# Altium schematic sheet LEFT_CCM.SchDoc: =project_title
size Tabloid; PageSetup: Record=PageOptions|CenterHorizontal=True|CenterVertical=True|PrintScale=0.71|XCorrection=1.00|YCorrection=1.00|PrintKind=0|BorderSize=5000000|LeftOffset=0|BottomOffset=0|Orientation=2|PaperLength=1000|PaperWidth=1000|Scale=100|PaperSource=7|PrintQuality=-4|MediaType=1|DitherType=10|PrintScaleMode=1|PaperKind=A4; CompanyName: Luxonis Holding; Organization: Luxonis Holding; Address1: 1925 Harmony Park Drive; Address2: Westminster, CO; Address3: 80234; Address4: United States; SheetNumber: 10; SheetTotal: 14
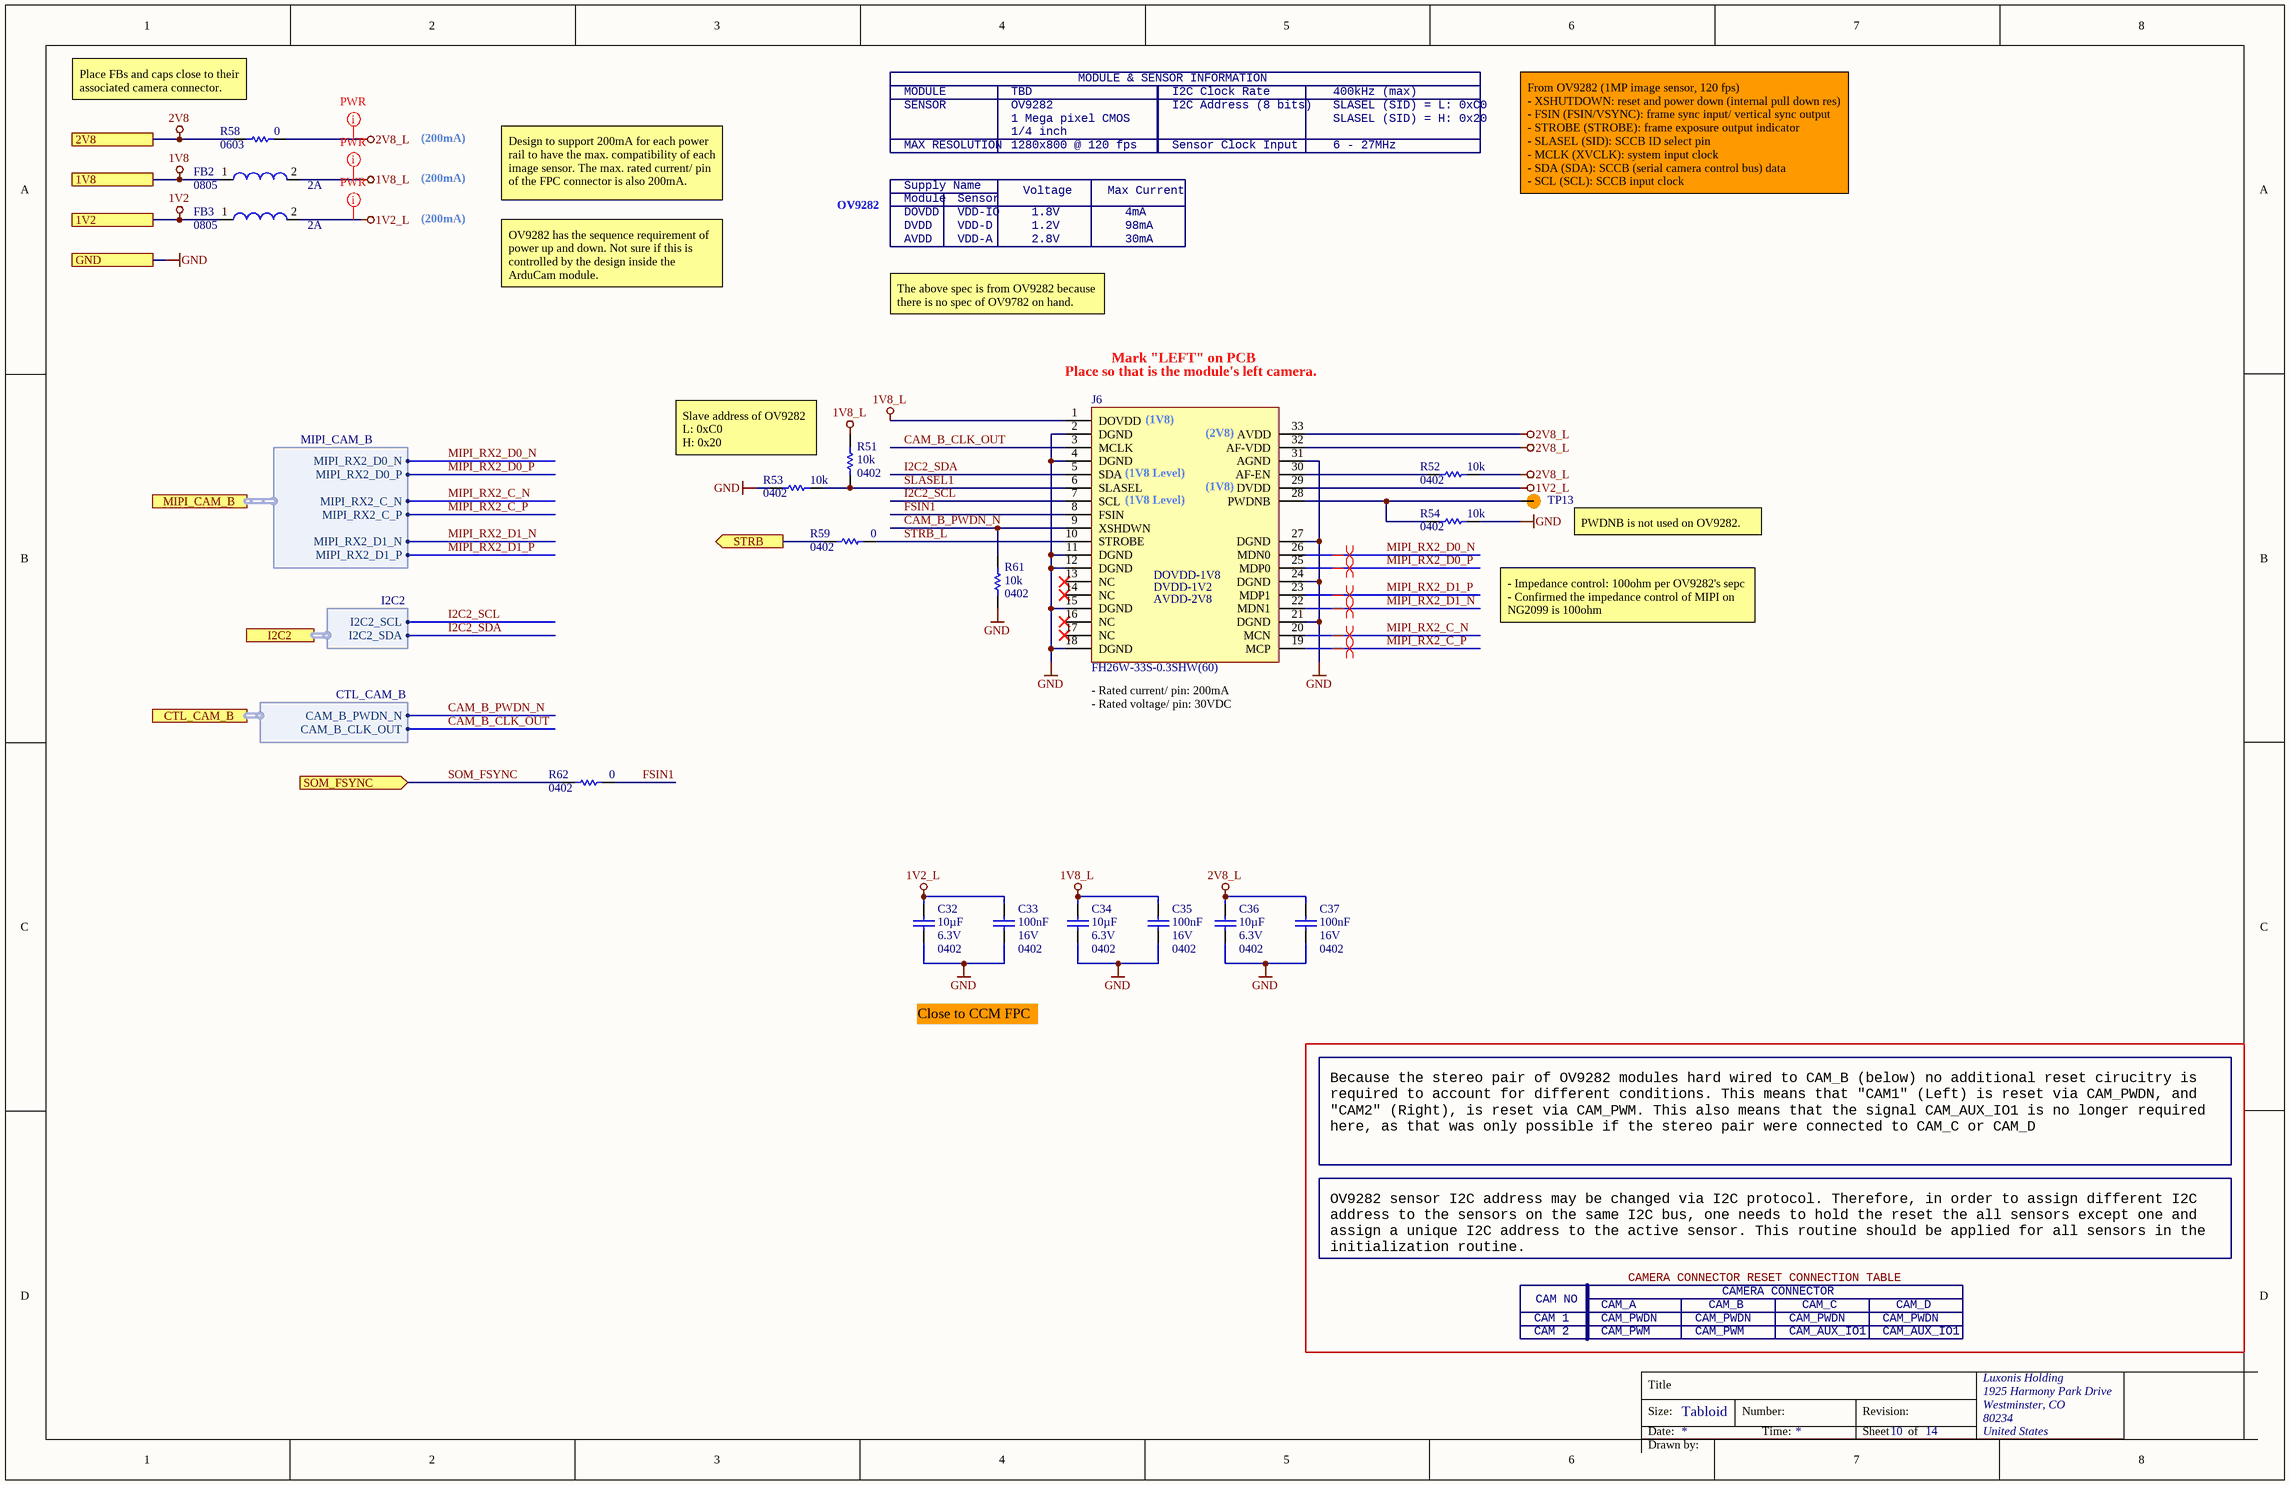
[diagram p0: LEFT_CCM.SchDoc]

## Parts
C32  value 10µF  Voltage Rating: 6.3V  Case/Package: 0402  [CAPC0402(1005)70_N]  (hidden comment: GRM155R60J106ME15D)
C33  value 100nF  Voltage Rating: 16V  Case/Package: 0402  [CAPC0402(1005)60_N]  (hidden comment: CL05B104KO5NFNC)
C34  value 10µF  Voltage Rating: 6.3V  Case/Package: 0402  [CAPC0402(1005)70_N]  (hidden comment: GRM155R60J106ME15D)
C35  value 100nF  Voltage Rating: 16V  Case/Package: 0402  [CAPC0402(1005)60_N]  (hidden comment: CL05B104KO5NFNC)
C36  value 10µF  Voltage Rating: 6.3V  Case/Package: 0402  [CAPC0402(1005)70_N]  (hidden comment: GRM155R60J106ME15D)
C37  value 100nF  Voltage Rating: 16V  Case/Package: 0402  [CAPC0402(1005)60_N]  (hidden comment: CL05B104KO5NFNC)
FB2  Current Rating: 2A  Case/Package: 0805  [2508056017Y2]  (hidden comment: 2508056017Y2)
FB3  Current Rating: 2A  Case/Package: 0805  [2508056017Y2]  (hidden comment: 2508056017Y2)
J6  FH26W-33S-0.3SHW(60)  [AC-PY003-OV9282]
R51  value 10k  Case/Package: 0402  [RESC0402(1005)_N]  (hidden comment: RC0402FR-1310KL)
R52  value 10k  Case/Package: 0402  [RESC0402(1005)_N]  (hidden comment: RC0402FR-1310KL)
R53  value 10k  Case/Package: 0402  [RESC0402(1005)_N]  (hidden comment: RC0402FR-1310KL)
R54  value 10k  Case/Package: 0402  [RESC0402(1005)_N]  (hidden comment: RC0402FR-1310KL)
R58  value 0  Case/Package: 0603  [RESC0603(1608)_N]  (hidden comment: CRCW06030000Z0EA)
R59  value 0  Case/Package: 0402  [RESC0402(1005)_L]  (hidden comment: CRCW04020000Z0ED)
R61  value 10k  Case/Package: 0402  [RESC0402(1005)_N]  (hidden comment: RC0402FR-1310KL)
R62  value 0  Case/Package: 0402  [RESC0402(1005)_L]  (hidden comment: CRCW04020000Z0ED)
TP13  TP075_150_NS  [TP075_150_NS]  (value not drawn)  (no BOM)

## Ports
1V2, 1V8, 2V8, CTL_CAM_B (harness CTL_CAM_B), GND, I2C2 (harness I2C2), MIPI_CAM_B (harness MIPI_CAM_B), SOM_FSYNC (in), STRB (out)

## Harnesses
MIPI_CAM_B: MIPI_RX2_D1_P, MIPI_RX2_D1_N, MIPI_RX2_D0_N, MIPI_RX2_D0_P, MIPI_RX2_C_N, MIPI_RX2_C_P
I2C2: I2C2_SDA, I2C2_SCL
CTL_CAM_B: CAM_B_PWDN_N, CAM_B_CLK_OUT

## Nets
1V2: FB3.1 ; port 1V2
1V2_L: C32.2 C33.2 FB3.2 J6.29(DVDD)
1V8: FB2.1 ; port 1V8
1V8_L: C34.2 C35.2 FB2.2 J6.1(DOVDD) R51.2
2V8: R58.1 ; port 2V8
2V8_L: C36.2 C37.2 J6.32(AF-VDD) J6.33(AVDD) R52.2 R58.2
GND: C32.1 C33.1 C34.1 C35.1 C36.1 C37.1 J6.2(DGND) J6.4(DGND) J6.11(DGND) J6.12(DGND) J6.15(DGND) J6.18(DGND) J6.21(DGND) J6.24(DGND) J6.27(DGND) J6.31(AGND) R53.1 R54.2 R61.1 ; port GND
CAM_B_CLK_OUT: J6.3(MCLK) ; port CTL_CAM_B.CAM_B_CLK_OUT
CAM_B_PWDN_N: J6.9(XSHDWN) R61.2 ; port CTL_CAM_B.CAM_B_PWDN_N
FSIN1: J6.8(FSIN) R62.1
I2C2_SCL: J6.7(SCL) ; port I2C2.I2C2_SCL
I2C2_SDA: J6.5(SDA) ; port I2C2.I2C2_SDA
MIPI_RX2_C_N: J6.20(MCN) ; port MIPI_CAM_B.MIPI_RX2_C_N
MIPI_RX2_C_P: J6.19(MCP) ; port MIPI_CAM_B.MIPI_RX2_C_P
MIPI_RX2_D0_N: J6.26(MDN0) ; port MIPI_CAM_B.MIPI_RX2_D0_N
MIPI_RX2_D0_P: J6.25(MDP0) ; port MIPI_CAM_B.MIPI_RX2_D0_P
MIPI_RX2_D1_N: J6.22(MDN1) ; port MIPI_CAM_B.MIPI_RX2_D1_N
MIPI_RX2_D1_P: J6.23(MDP1) ; port MIPI_CAM_B.MIPI_RX2_D1_P
SLASEL1: J6.6(SLASEL) R51.1 R53.2
SOM_FSYNC: R62.2 ; port SOM_FSYNC
STRB: R59.2 ; port STRB
STRB_L: J6.10(STROBE) R59.1
NetJ6_28: J6.28(PWDNB) R54.1 TP13.1
NetJ6_30: J6.30(AF-EN) R52.1

Not connected (* = marked no-connect by the designer): J6 13(NC)* 14(NC)* 16(NC)* 17(NC)*

## Layout directives
differential pair; net class MIPI; differential pair class 100ohm: MIPI_RX2_C_N, MIPI_RX2_C_P, MIPI_RX2_D0_N, MIPI_RX2_D0_P, MIPI_RX2_D1_N, MIPI_RX2_D1_P
net class PWR; Current Rating: 200mA: 1V2_L, 1V8_L, 2V8_L

## Notes on the sheet
- (near R58) Place FBs and caps close to their associated camera connector.
- MODULE
- TBD
- MODULE & SENSOR INFORMATION
- I2C Clock Rate
- 400kHz (max)
- (200mA)
- SENSOR
- MAX RESOLUTION
- 1 Mega pixel CMOS
- 1280x800 @ 120 fps
- OV9282
- 1/4 inch
- I2C Address (8 bits)
- Sensor Clock Input
- SLASEL (SID) = L: 0xC0
- SLASEL (SID) = H: 0x20
- 6 - 27MHz
- Design to support 200mA for each power rail to have the max. compatibility of each image sensor. The max. rated current/ pin of the FPC connector is also 200mA.
- DOVDD
- DVDD
- Supply Name
- Module
- VDD-IO
- VDD-D
- Sensor
- Voltage
- 1.8V
- 1.2V
- Max Current
- 4mA
- 98mA
- From OV9282 (1MP image sensor, 120 fps)
  - XSHUTDOWN: reset and power down (internal pull down res)
  - FSIN (FSIN/VSYNC): frame sync input/ vertical sync output
  - STROBE (STROBE): frame exposure output indicator
  - SLASEL (SID): SCCB ID select pin
  - MCLK (XVCLK): system input clock
  - SDA (SDA): SCCB (serial camera control bus) data
  - SCL (SCL): SCCB input clock
- OV9282 has the sequence requirement of power up and down. Not sure if this is controlled by the design inside the ArduCam module.
- AVDD
- VDD-A
- 2.8V
- 30mA
- The above spec is from OV9282 because there is no spec of OV9782 on hand.
- Mark "LEFT" on PCB
- (near J6) Place so that is the module's left camera.
- (near J6) (1V8)
- (near J6) (2V8)
- Slave address of OV9282
  L: 0xC0
  H: 0x20
- (near J6) (1V8 Level)
- (near TP13) PWDNB is not used on OV9282.
- - Impedance control: 100ohm per OV9282's sepc
  - Confirmed the impedance control of MIPI on NG2099 is 100ohm
- (near J6) - Rated current/ pin: 200mA
  - Rated voltage/ pin: 30VDC
- Close to CCM FPC
- Because the stereo pair of OV9282 modules hard wired to CAM_B (below) no additional reset cirucitry is required to account for different conditions. This means that "CAM1" (Left) is reset via CAM_PWDN, and "CAM2" (Right), is reset via CAM_PWM. This also means that the signal CAM_AUX_IO1 is no longer required here, as that was only possible if the stereo pair were connected to CAM_C or CAM_D
- OV9282 sensor I2C address may be changed via I2C protocol. Therefore, in order to assign different I2C address to the sensors on the same I2C bus, one needs to hold the reset the all sensors except one and assign a unique I2C address to the active sensor. This routine should be applied for all sensors in the initialization routine.
- CAM NO
- CAMERA CONNECTOR RESET CONNECTION TABLE
- CAMERA CONNECTOR
- CAM 1
- CAM 2
- CAM_A
- CAM_PWDN
- CAM_PWM
- CAM_B
- CAM_AUX_IO1
- CAM_C
- CAM_D
- Title
- Size:
- Date:
- Tabloid
- Number:
- Time:
- Revision:
- Sheet
- of
- Drawn by:
- (in symbol AC_PY003-OV9282_CON) DOVDD-1V8; DVDD-1V2; AVDD-2V8

## Library data of the parts
C32 C34 C36 = CMP-004-000009-5: CAP CER 10UF 6.3V X5R 0402 20%; Manufacturer 1: Murata; Dielectric: X5R; Manufacturer Part Number 1: GRM155R60J106ME15D; ComponentLink1URL: https://www.murata.com/~/media/webrenewal/support/library/catalog/products/capacitor/mlcc/c02e.ashx?la=en-us&src-supplier=Digi-Key; Design Item ID: GRM155R60J106ME15D; Tolerance: 20%; Width: 0.02inch; Length: 0.039inch; Mounting Technology: SMT; Min Operating Temperature: -55°C; Max Operating Temperature: 85°C; ComponentLink1Description: https://www.murata.com/~/media/webrenewal/support/library/catalog/products/capacitor/mlcc/c02e.ashx?la=en-us&src-supplier=Digi-Key
C33 C35 C37 = CMP-108-000002-6: CAP CER 0.1UF 16V X7R 0402 10%; Manufacturer 1: Samsung; ComponentLink1URL: https://datasheet.ciiva.com/25767/cl05b104ko5nfnc-25767124.pdf?src-supplier=Digi-Key; Length: 1mm; Design Item ID: CL05B104KO5NFNC; Tolerance: 10%; Min Operating Temperature: -55°C; Width: 0.02inch; Dielectric: X7R; ComponentLink1Description: https://datasheet.ciiva.com/25767/cl05b104ko5nfnc-25767124.pdf?src-supplier=Digi-Key; Height: 0.5mm; Depth: 0.5mm; Manufacturer Part Number 1: CL05B104KO5NFNC; Max Operating Temperature: 125°C; Mounting Technology: SMT
FB2 FB3 = CMP-082-000000-2: FERRITE BEAD, 0.1OHM, 2A, 0805, 600R/100MHz; Manufacturer 1: Fair-Rite; Tolerance: 25%; Manufacturer Part Number 1: 2508056017Y2
J6 = AC_PY003-OV9282_CON: FFC/FPC Connector, 33 Contact(s), 1 Row(s), Female, Right Angle, Surface Mount Terminal; Manufacturer 1: Hirose; Supplier 1: Digi-Key; Manufacturer Part Number 1: FH26W-33S-0.3SHW(60); RoHS: Yes; Category: FFC / FPC; Stock 1: 627; Pricing 1: 1=1,78000, 10=1,61700, 25=1,51800, 50=1,45200, 100=1,38600, 250=1,25400, 500=1,15500, 1000=0,99000, 2500=0,92400 (USD); ComponentLink1URL: https://datasheet.ciiva.com:443/pdfs/VipMasterIC/IC/HIRO/HIRO-S-A0007913874/HIRO-S-A0008593114-1.pdf?src-supplier=IHS+Markit; ComponentLink1Description: https://datasheet.ciiva.com:443/pdfs/VipMasterIC/IC/HIRO/HIRO-S-A0007913874/HIRO-S-A0008593114-1.pdf?src-supplier=IHS+Markit; ComponentLink2URL: https://www.hirose.com/product/en/download_file/key_name/FH26/category/Catalog/doc_file_id/49355/?file_category_id=4&item_id=298&is_series=1&src-supplier=Digi-Key; ComponentLink2Description: https://www.hirose.com/product/en/download_file/key_name/FH26/category/Catalog/doc_file_id/49355/?file_category_id=4&item_id=298&is_series=1&src-supplier=Digi-Key; ComponentLink3URL: https://www.hirose.com/product/download/?distributor=digikey&amp;type=2d&amp;lang=en&amp;num=FH26W-13S-0.3SHW(60)&src-supplier=Digi-Key; ComponentLink3Description: https://www.hirose.com/product/download/?distributor=digikey&amp;type=2d&amp;lang=en&amp;num=FH26W-13S-0.3SHW(60)&src-supplier=Digi-Key; Supplier Part Number 1: H125800CT-ND
R51-R54 R61 = CMP-115-000004-8: RES SMD 10K OHM 1% 1/16W 0402; Manufacturer 1: Yageo; Power Rating: 62.5mW; Temperature Coefficient: 100ppm/°C; Voltage Rating: 50V; Min Operating Temperature: -55°C; Max Operating Temperature: 155°C; Design Item ID: RC0402FR-1310KL; Tolerance: 1%; Manufacturer Part Number 1: RC0402FR-1310KL
R58 = CMP-115-000011-7: RES SMD 0 OHM 5% 1/10W 0603; Manufacturer 1: Vishay; Manufacturer Part Number 1: CRCW0603-0000Z0EA; Temperature Coefficient: 100ppm/°C; Power Rating: 100mW; Voltage Rating: 75V; Tolerance: 5%; Design Item ID: CRCW06030000Z0EA; Max Operating Temperature: 155°C; Min Operating Temperature: -55°C
R59 R62 = CMP-013-000022-11: RES SMD 0 OHM 5% 1/16W 0402; Manufacturer 1: Vishay; Voltage Rating: 50V; Power Rating: 63mW; Max Operating Temperature: 155°C; Manufacturer Part Number 1: CRCW04020000Z0ED; Tolerance: 5%; Min Operating Temperature: -55°C; Design Item ID: CRCW04020000Z0ED
TP13 = TEST_POINT